# Altium schematic sheet MOUNTING_HOLE.SchDoc
size 420 x 297 mm; SheetNumber: 20; SheetTotal: 20
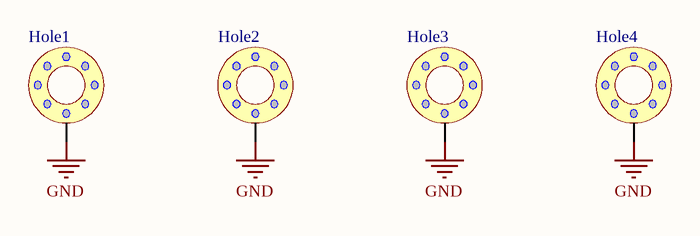
[diagram p0: MOUNTING_HOLE.SchDoc]

## Parts
Hole1  hole_space  [HEX-M3_NoVia]  (value not drawn)
Hole2  hole_space  [HEX-M3_NoVia]  (value not drawn)
Hole3  hole_space  [HEX-M3_NoVia]  (value not drawn)
Hole4  hole_space  [HEX-M3_NoVia]  (value not drawn)

## Nets
GND: Hole1.1 Hole2.1 Hole3.1 Hole4.1

## Notes on the sheet
- Project:
- Sub-system:
- Design by:
- Sheet title:
- Sheet
- A3
- of
- Checked by:
- Approved by:
- Revision:
- Document No:
- Size:
- Date: